# Altium schematic sheet Overview_Sheet.SchDoc: Overview Sheet
size B; CheckedBy: Jason Sullins; Author: Jordan Harris-Toovy; Revision: 0.2; SheetNumber: 1; SheetTotal: 22; Size: ANSI B
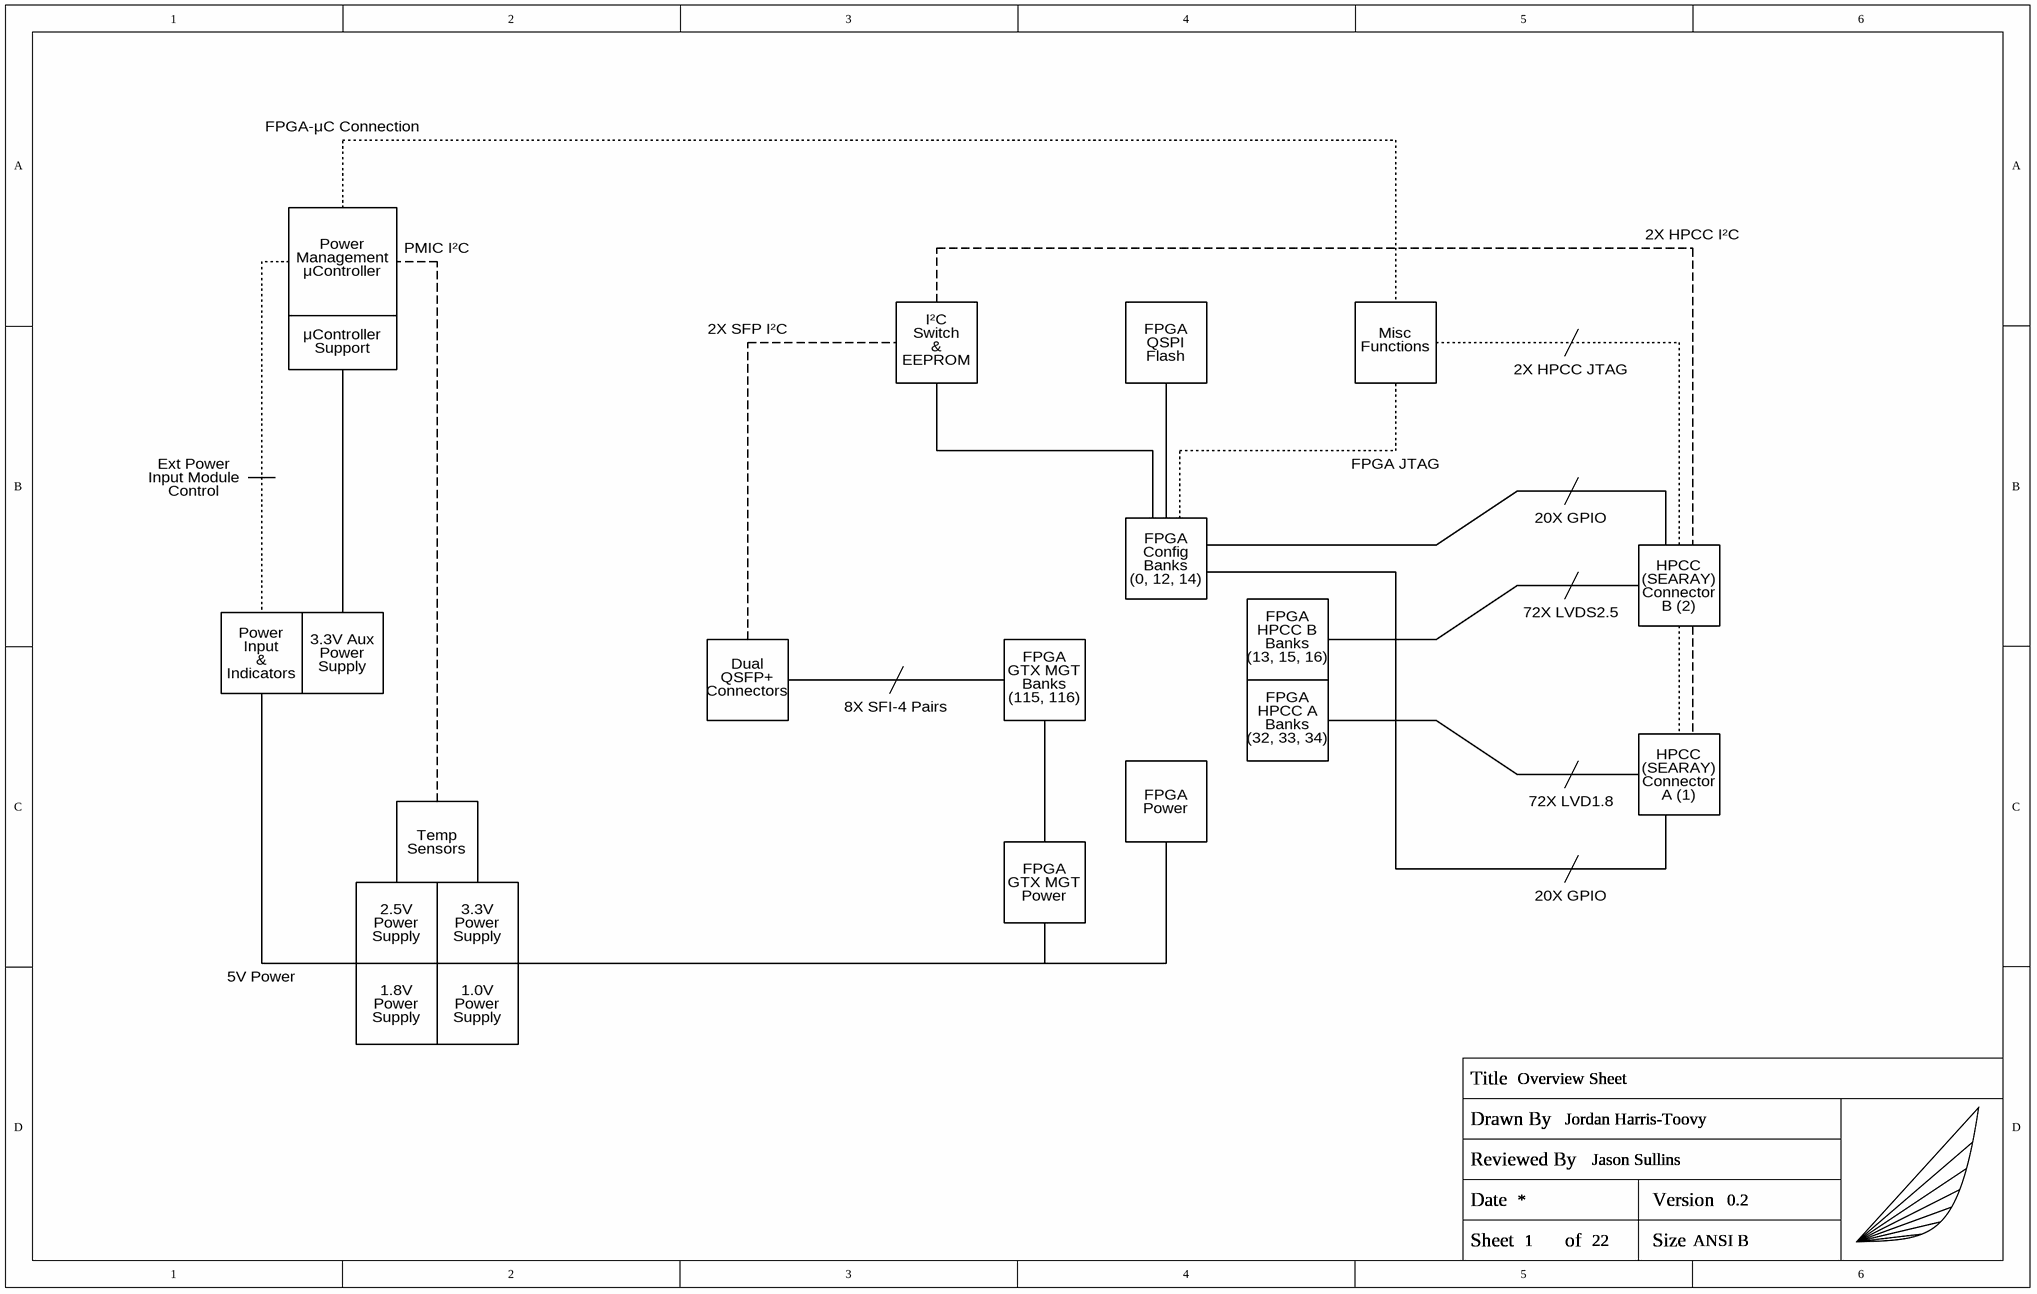
[diagram p0: Overview_Sheet.SchDoc]

## Parts
TITLEBLOCK?  Capstone_Title_Block  (value not drawn)  (graphical)

## Sub-sheets
1.0V Power Supply = PMIC_1V0.SchDoc: no entries
1.8V Power Supply = PMIC_1V8.SchDoc: no entries
2.5V Power Supply = PMIC_2V5.SchDoc: no entries
3.3V Auxiliary Power Supply = PMIC_3V3AUX_PWR-DEF.SchDoc: no entries
3.3V Power Supply = PMIC_3V3.SchDoc: no entries
FPGA Configuration Banks = FGPA_Configuration.SchDoc: no entries
FPGA GTX Banks = FPGA_GTXs.SchDoc: no entries
FPGA HPCC A Banks = FPGA_HPCC_A_DPs.SchDoc: no entries
FPGA HPCC B Banks = FPGA_HPCC_B_DPs.SchDoc: no entries
FPGA Power Banks = FPGA_Power.SchDoc: no entries
FPGA QSPI FLASH = Flash_FPGA.SchDoc: no entries
GTX Power Supplies = PMIC_GTXs.SchDoc: no entries
HPCC Connector A = HPCC_Connector_A.SchDoc: no entries
HPCC Connector B = HPCC_Connector_B.SchDoc: no entries
I2C Switch & EEPROM = I2C_Switch_EEPROM.SchDoc: no entries
Management Microcontroller = Management_RP2040.SchDoc: no entries
Management Microcontroller Support = Management_RP2040_Support.SchDoc: no entries
Miscellaneous Functions = Miscellaneous_Functions.SchDoc: no entries
PMIC-Area Temperature Sensors = I2C_Temperature_Sensors.SchDoc: no entries
Power Inputs and LEDs = Power_Input_Indicators.SchDoc: no entries
QSFP+ Connectors = QSFP_Connectors.SchDoc: no entries

## Notes on the sheet
- FPGA-μC Connection
- 2X HPCC I²C
- Power
- Management
- μController
- PMIC I²C
- Support
- 2X SFP I²C
- I²C
- Switch
- &
- EEPROM
- FPGA
- QSPI
- Flash
- Misc
- Functions
- 2X HPCC JTAG
- Ext Power
- Input Module
- Control
- FPGA JTAG
- Config
- Banks
- 20X GPIO
- HPCC
- Input
- 3.3V Aux
- (0, 12, 14)
- HPCC B
- 72X LVDS2.5
- (SEARAY)
- Connector
- B (2)
- Indicators
- Supply
- Dual
- QSFP+
- Connectors
- 8X SFI-4 Pairs
- GTX MGT
- (115, 116)
- (13, 15, 16)
- HPCC A
- (32, 33, 34)
- Temp
- 72X LVD1.8
- A (1)
- 2.5V
- Sensors
- 3.3V
- 5V Power
- 1.8V
- 1.0V
- (in symbol Capstone_Title_Block) Title; Drawn By; Reviewed By; Date; Version; Sheet; of; Size

## Library data of the parts
TITLEBLOCK? = Capstone_Title_Block: Custom title block with personal logo; Manufacturer: NONE; Manufacturer Part Number: NONE